# EAGLE schematic reg-board (EAGLE 8.7.0)

## Sheet 1 of 5: Bus Buffering
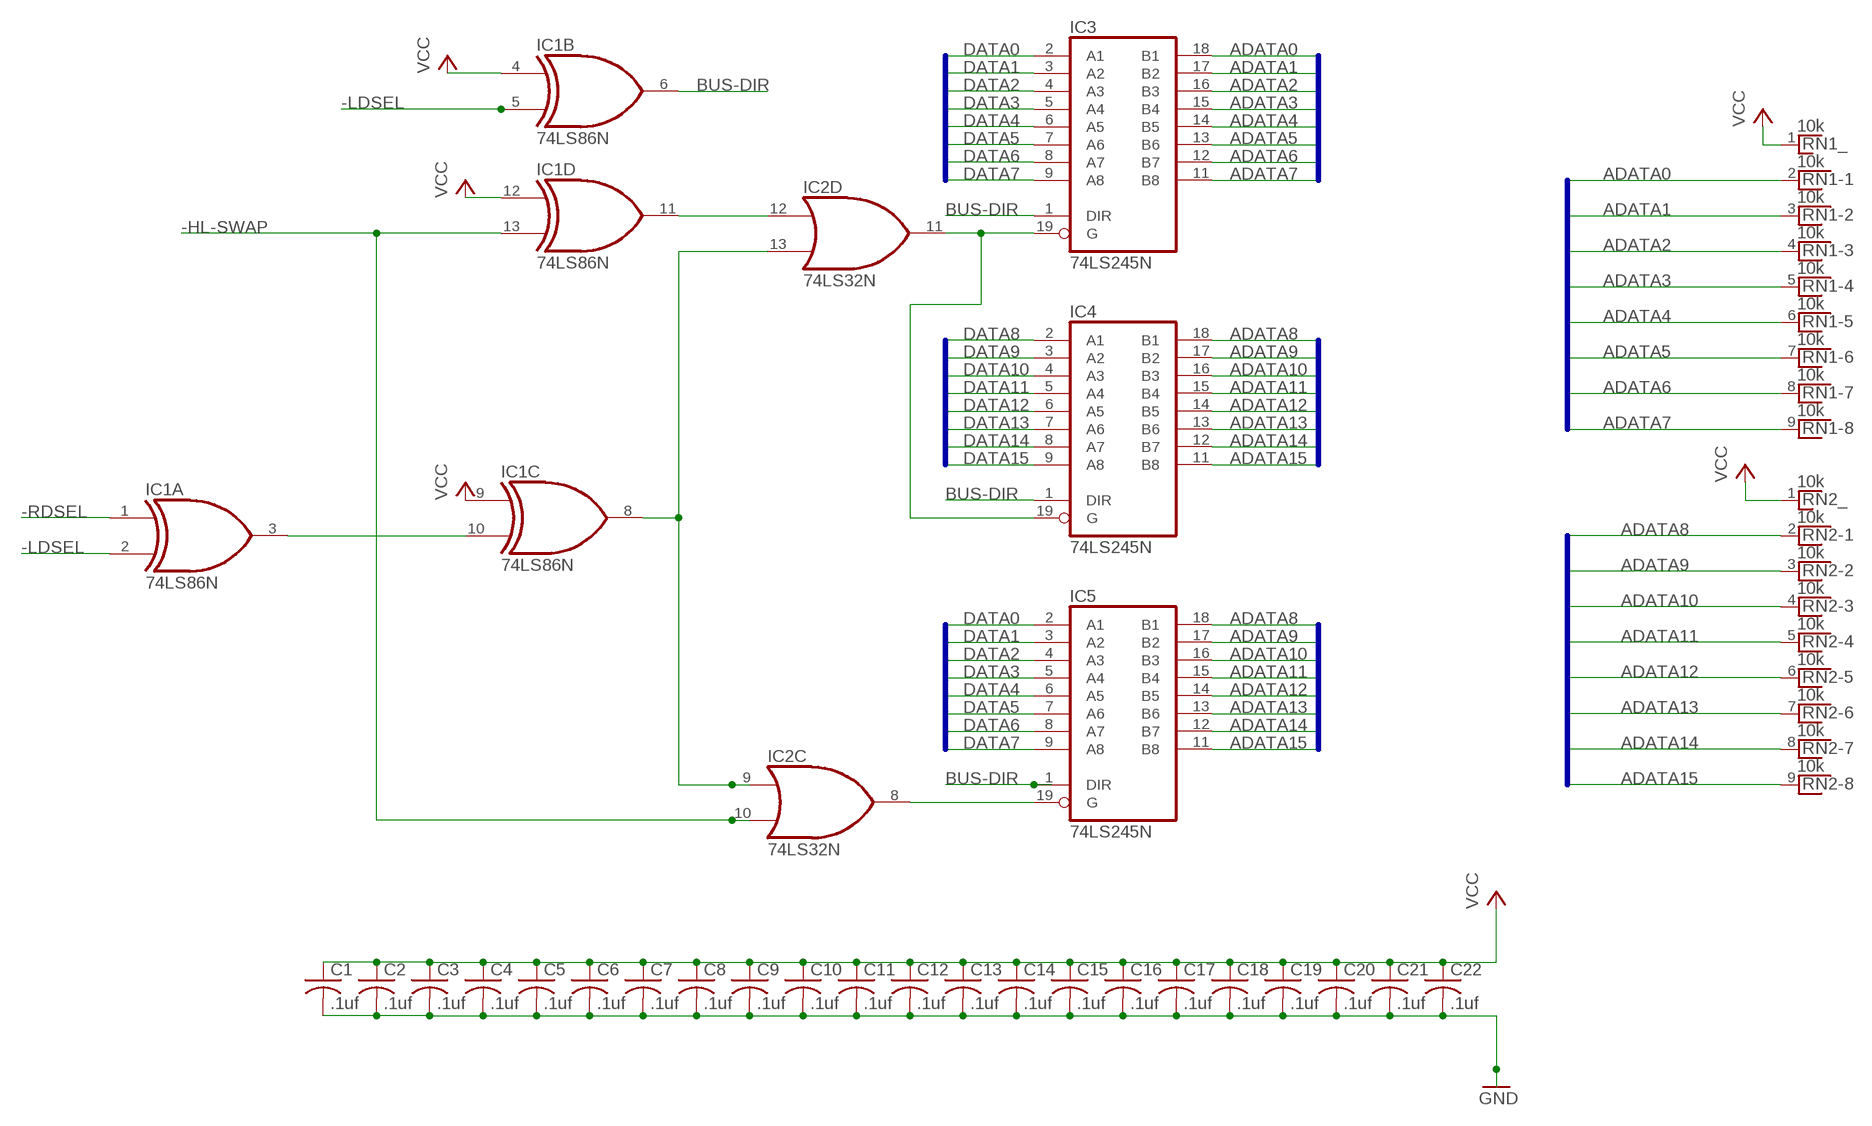
[diagram p0: schematic, sheet 1]

### Parts
C1  .1uf  C-US025-040X050  [C025-040X050]
C2  .1uf  C-US025-040X050  [C025-040X050]
C3  .1uf  C-US025-040X050  [C025-040X050]
C4  .1uf  C-US025-040X050  [C025-040X050]
C5  .1uf  C-US025-040X050  [C025-040X050]
C6  .1uf  C-US025-040X050  [C025-040X050]
C7  .1uf  C-US025-040X050  [C025-040X050]
C8  .1uf  C-US025-040X050  [C025-040X050]
C9  .1uf  C-US025-040X050  [C025-040X050]
C10  .1uf  C-US025-040X050  [C025-040X050]
C11  .1uf  C-US025-040X050  [C025-040X050]
C12  .1uf  C-US025-040X050  [C025-040X050]
C13  .1uf  C-US025-040X050  [C025-040X050]
C14  .1uf  C-US025-040X050  [C025-040X050]
C15  .1uf  C-US025-040X050  [C025-040X050]
C16  .1uf  C-US025-040X050  [C025-040X050]
C17  .1uf  C-US025-040X050  [C025-040X050]
C18  .1uf  C-US025-040X050  [C025-040X050]
C19  .1uf  C-US025-040X050  [C025-040X050]
C20  .1uf  C-US025-040X050  [C025-040X050]
C21  .1uf  C-US025-040X050  [C025-040X050]
C22  .1uf  C-US025-040X050  [C025-040X050]
IC1  74LS86N  [DIL14]
IC2  74LS32N  [DIL14]
IC3  74LS245N  [DIL20]
IC4  74LS245N  [DIL20]
IC5  74LS245N  [DIL20]
RN1  10k  RNX8  [RN-9]
RN2  10k  RNX8  [RN-9]

### Nets
-HL-SWAP: IC1.13(D:I1) IC2.10(C:I1) ; also sheet 4
-LDSEL: IC1.2(A:I1) IC1.5(B:I1) ; also sheet 5
-RDSEL: IC1.1(A:I0) ; also sheet 5
ADATA0: IC3.18(B1) RN1.2 ; also sheet 2,3
ADATA1: IC3.17(B2) RN1.3 ; also sheet 2,3
ADATA2: IC3.16(B3) RN1.4 ; also sheet 2,3
ADATA3: IC3.15(B4) RN1.5 ; also sheet 2,3
ADATA4: IC3.14(B5) RN1.6 ; also sheet 2,3
ADATA5: IC3.13(B6) RN1.7 ; also sheet 2,3
ADATA6: IC3.12(B7) RN1.8 ; also sheet 2,3
ADATA7: IC3.11(B8) RN1.9 ; also sheet 2,3
ADATA8: IC4.18(B1) IC5.18(B1) RN2.2 ; also sheet 2,3
ADATA9: IC4.17(B2) IC5.17(B2) RN2.3 ; also sheet 2,3
ADATA10: IC4.16(B3) IC5.16(B3) RN2.4 ; also sheet 2,3
ADATA11: IC4.15(B4) IC5.15(B4) RN2.5 ; also sheet 2,3
ADATA12: IC4.14(B5) IC5.14(B5) RN2.6 ; also sheet 2,3
ADATA13: IC4.13(B6) IC5.13(B6) RN2.7 ; also sheet 2,3
ADATA14: IC4.12(B7) IC5.12(B7) RN2.8 ; also sheet 2,3
ADATA15: IC4.11(B8) IC5.11(B8) RN2.9 ; also sheet 2,3
BUS-DIR: IC1.6(B:O) IC3.1(DIR) IC4.1(DIR) IC5.1(DIR)
DATA0: IC3.2(A1) IC5.2(A1) ; also sheet 4
DATA1: IC3.3(A2) IC5.3(A2) ; also sheet 4
DATA2: IC3.4(A3) IC5.4(A3) ; also sheet 4
DATA3: IC3.5(A4) IC5.5(A4) ; also sheet 4
DATA4: IC3.6(A5) IC5.6(A5) ; also sheet 4
DATA5: IC3.7(A6) IC5.7(A6) ; also sheet 4
DATA6: IC3.8(A7) IC5.8(A7) ; also sheet 4
DATA7: IC3.9(A8) IC5.9(A8) ; also sheet 4
DATA8: IC4.2(A1) ; also sheet 4
DATA9: IC4.3(A2) ; also sheet 4
DATA10: IC4.4(A3) ; also sheet 4
DATA11: IC4.5(A4) ; also sheet 4
DATA12: IC4.6(A5) ; also sheet 4
DATA13: IC4.7(A6) ; also sheet 4
DATA14: IC4.8(A7) ; also sheet 4
DATA15: IC4.9(A8) ; also sheet 4
GND: C1.2 C2.2 C3.2 C4.2 C5.2 C6.2 C7.2 C8.2 C9.2 C10.2 C11.2 C12.2 C13.2 C14.2 C15.2 C16.2 C17.2 C18.2 C19.2 C20.2 C21.2 C22.2 ; also sheet 3,4
N$2: IC1.8(C:O) IC2.9(C:I0) IC2.13(D:I1)
N$3: IC1.3(A:O) IC1.10(C:I1)
N$5: IC1.11(D:O) IC2.12(D:I0)
N$37: IC2.8(C:O) IC5.19(G)
N$38: IC2.11(D:O) IC3.19(G) IC4.19(G)
VCC: C1.1 C2.1 C3.1 C4.1 C5.1 C6.1 C7.1 C8.1 C9.1 C10.1 C11.1 C12.1 C13.1 C14.1 C15.1 C16.1 C17.1 C18.1 C19.1 C20.1 C21.1 C22.1 IC1.4(B:I0) IC1.9(C:I0) IC1.12(D:I0) RN1.1 RN2.1 ; also sheet 3,4

### Buses
DATA[8..15]
DATA[0..7]
ADATA[0..7]
ADATA[8..15]

## Sheet 2 of 5: REGISTER FILE 1/2
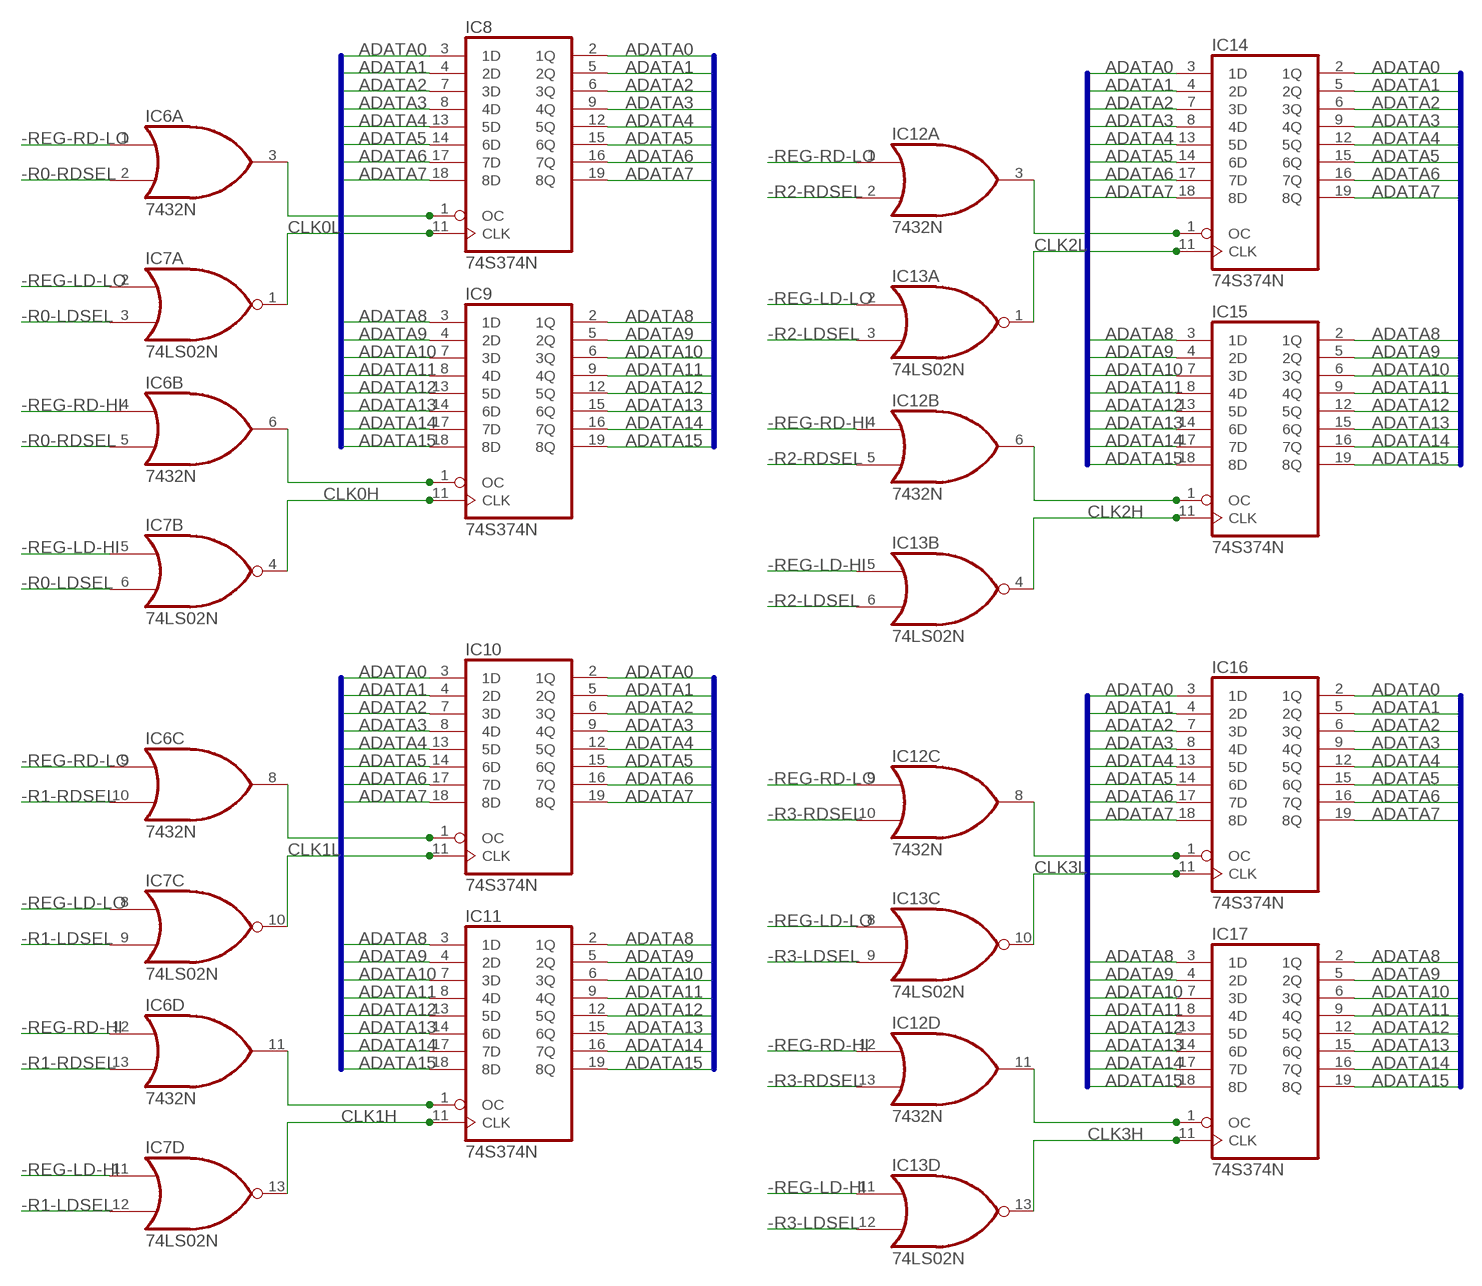
[diagram p1: schematic, sheet 2]

### Parts
IC6  7432N  [DIL14]
IC7  74LS02N  [DIL14]
IC8  74S374N  [DIL20]
IC9  74S374N  [DIL20]
IC10  74S374N  [DIL20]
IC11  74S374N  [DIL20]
IC12  7432N  [DIL14]
IC13  74LS02N  [DIL14]
IC14  74S374N  [DIL20]
IC15  74S374N  [DIL20]
IC16  74S374N  [DIL20]
IC17  74S374N  [DIL20]

### Nets
-R0-LDSEL: IC7.3(A:I1) IC7.6(B:I1) ; also sheet 5
-R0-RDSEL: IC6.2(A:I1) IC6.5(B:I1) ; also sheet 5
-R1-LDSEL: IC7.9(C:I1) IC7.12(D:I1) ; also sheet 5
-R1-RDSEL: IC6.10(C:I1) IC6.13(D:I1) ; also sheet 5
-R2-LDSEL: IC13.3(A:I1) IC13.6(B:I1) ; also sheet 5
-R2-RDSEL: IC12.2(A:I1) IC12.5(B:I1) ; also sheet 5
-R3-LDSEL: IC13.9(C:I1) IC13.12(D:I1) ; also sheet 5
-R3-RDSEL: IC12.10(C:I1) IC12.13(D:I1) ; also sheet 5
-REG-LD-HI: IC7.5(B:I0) IC7.11(D:I0) IC13.5(B:I0) IC13.11(D:I0) ; also sheet 4
-REG-LD-LO: IC7.2(A:I0) IC7.8(C:I0) IC13.2(A:I0) IC13.8(C:I0) ; also sheet 4
-REG-RD-HI: IC6.4(B:I0) IC6.12(D:I0) IC12.4(B:I0) IC12.12(D:I0) ; also sheet 4
-REG-RD-LO: IC6.1(A:I0) IC6.9(C:I0) IC12.1(A:I0) IC12.9(C:I0) ; also sheet 4
ADATA0: IC8.2(1Q) IC8.3(1D) IC10.2(1Q) IC10.3(1D) IC14.2(1Q) IC14.3(1D) IC16.2(1Q) IC16.3(1D) ; also sheet 1,3
ADATA1: IC8.4(2D) IC8.5(2Q) IC10.4(2D) IC10.5(2Q) IC14.4(2D) IC14.5(2Q) IC16.4(2D) IC16.5(2Q) ; also sheet 1,3
ADATA2: IC8.6(3Q) IC8.7(3D) IC10.6(3Q) IC10.7(3D) IC14.6(3Q) IC14.7(3D) IC16.6(3Q) IC16.7(3D) ; also sheet 1,3
ADATA3: IC8.8(4D) IC8.9(4Q) IC10.8(4D) IC10.9(4Q) IC14.8(4D) IC14.9(4Q) IC16.8(4D) IC16.9(4Q) ; also sheet 1,3
ADATA4: IC8.12(5Q) IC8.13(5D) IC10.12(5Q) IC10.13(5D) IC14.12(5Q) IC14.13(5D) IC16.12(5Q) IC16.13(5D) ; also sheet 1,3
ADATA5: IC8.14(6D) IC8.15(6Q) IC10.14(6D) IC10.15(6Q) IC14.14(6D) IC14.15(6Q) IC16.14(6D) IC16.15(6Q) ; also sheet 1,3
ADATA6: IC8.16(7Q) IC8.17(7D) IC10.16(7Q) IC10.17(7D) IC14.16(7Q) IC14.17(7D) IC16.16(7Q) IC16.17(7D) ; also sheet 1,3
ADATA7: IC8.18(8D) IC8.19(8Q) IC10.18(8D) IC10.19(8Q) IC14.18(8D) IC14.19(8Q) IC16.18(8D) IC16.19(8Q) ; also sheet 1,3
ADATA8: IC9.2(1Q) IC9.3(1D) IC11.2(1Q) IC11.3(1D) IC15.2(1Q) IC15.3(1D) IC17.2(1Q) IC17.3(1D) ; also sheet 1,3
ADATA9: IC9.4(2D) IC9.5(2Q) IC11.4(2D) IC11.5(2Q) IC15.4(2D) IC15.5(2Q) IC17.4(2D) IC17.5(2Q) ; also sheet 1,3
ADATA10: IC9.6(3Q) IC9.7(3D) IC11.6(3Q) IC11.7(3D) IC15.6(3Q) IC15.7(3D) IC17.6(3Q) IC17.7(3D) ; also sheet 1,3
ADATA11: IC9.8(4D) IC9.9(4Q) IC11.8(4D) IC11.9(4Q) IC15.8(4D) IC15.9(4Q) IC17.8(4D) IC17.9(4Q) ; also sheet 1,3
ADATA12: IC9.12(5Q) IC9.13(5D) IC11.12(5Q) IC11.13(5D) IC15.12(5Q) IC15.13(5D) IC17.12(5Q) IC17.13(5D) ; also sheet 1,3
ADATA13: IC9.14(6D) IC9.15(6Q) IC11.14(6D) IC11.15(6Q) IC15.14(6D) IC15.15(6Q) IC17.14(6D) IC17.15(6Q) ; also sheet 1,3
ADATA14: IC9.16(7Q) IC9.17(7D) IC11.16(7Q) IC11.17(7D) IC15.16(7Q) IC15.17(7D) IC17.16(7Q) IC17.17(7D) ; also sheet 1,3
ADATA15: IC9.18(8D) IC9.19(8Q) IC11.18(8D) IC11.19(8Q) IC15.18(8D) IC15.19(8Q) IC17.18(8D) IC17.19(8Q) ; also sheet 1,3
CLK0H: IC7.4(B:O) IC9.11(CLK) ; also sheet 3
CLK0L: IC7.1(A:O) IC8.11(CLK) ; also sheet 3
CLK1H: IC7.13(D:O) IC11.11(CLK) ; also sheet 3
CLK1L: IC7.10(C:O) IC10.11(CLK) ; also sheet 3
CLK2H: IC13.4(B:O) IC15.11(CLK) ; also sheet 3
CLK2L: IC13.1(A:O) IC14.11(CLK) ; also sheet 3
CLK3H: IC13.13(D:O) IC17.11(CLK) ; also sheet 3
CLK3L: IC13.10(C:O) IC16.11(CLK) ; also sheet 3
N$1: IC6.3(A:O) IC8.1(OC)
N$12: IC6.8(C:O) IC10.1(OC)
N$15: IC12.3(A:O) IC14.1(OC)
N$17: IC12.8(C:O) IC16.1(OC)
N$19: IC6.11(D:O) IC11.1(OC)
N$21: IC12.11(D:O) IC17.1(OC)
N$23: IC12.6(B:O) IC15.1(OC)
N$25: IC6.6(B:O) IC9.1(OC)

### Buses
ADATA[0..15]

## Sheet 3 of 5: FRONT PANEL CONNECTOR
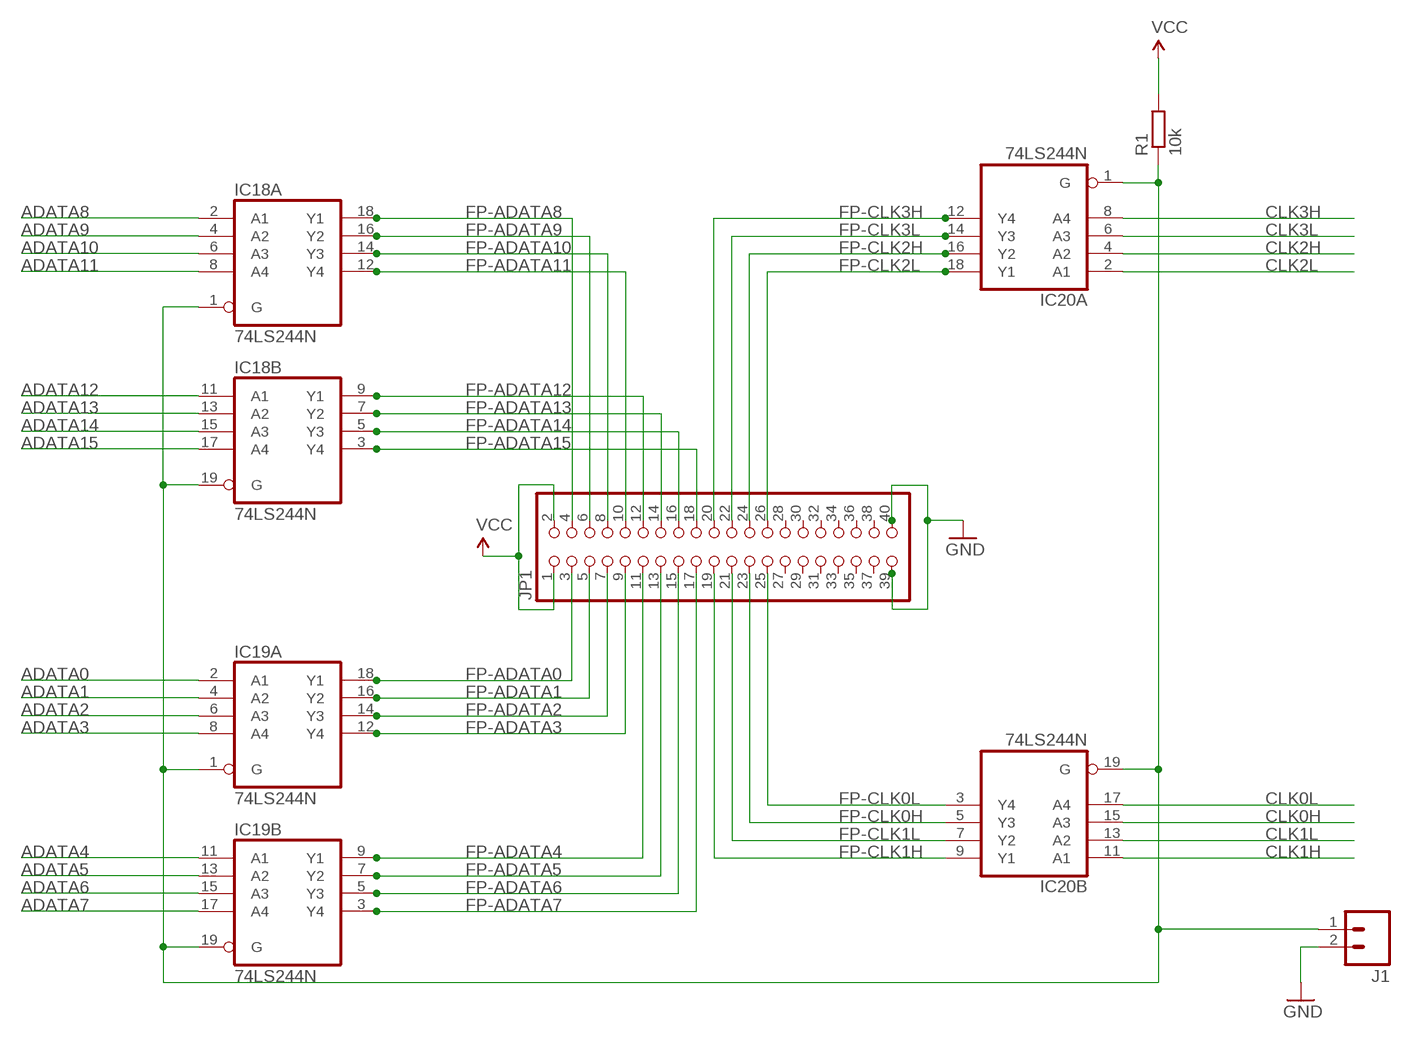
[diagram p2: schematic, sheet 3]

### Parts
IC18  74LS244N  [DIL20]
IC19  74LS244N  [DIL20]
IC20  74LS244N  [DIL20]
J1  M02PTH  [1X02]
JP1  PINHD-2X20  [2X20]
R1  10k  R0207/10  [0207/10]

### Nets
ADATA0: IC19.2(A:A1) ; also sheet 1,2
ADATA1: IC19.4(A:A2) ; also sheet 1,2
ADATA2: IC19.6(A:A3) ; also sheet 1,2
ADATA3: IC19.8(A:A4) ; also sheet 1,2
ADATA4: IC19.11(B:A1) ; also sheet 1,2
ADATA5: IC19.13(B:A2) ; also sheet 1,2
ADATA6: IC19.15(B:A3) ; also sheet 1,2
ADATA7: IC19.17(B:A4) ; also sheet 1,2
ADATA8: IC18.2(A:A1) ; also sheet 1,2
ADATA9: IC18.4(A:A2) ; also sheet 1,2
ADATA10: IC18.6(A:A3) ; also sheet 1,2
ADATA11: IC18.8(A:A4) ; also sheet 1,2
ADATA12: IC18.11(B:A1) ; also sheet 1,2
ADATA13: IC18.13(B:A2) ; also sheet 1,2
ADATA14: IC18.15(B:A3) ; also sheet 1,2
ADATA15: IC18.17(B:A4) ; also sheet 1,2
CLK0H: IC20.15(B:A3) ; also sheet 2
CLK0L: IC20.17(B:A4) ; also sheet 2
CLK1H: IC20.11(B:A1) ; also sheet 2
CLK1L: IC20.13(B:A2) ; also sheet 2
CLK2H: IC20.4(A:A2) ; also sheet 2
CLK2L: IC20.2(A:A1) ; also sheet 2
CLK3H: IC20.8(A:A4) ; also sheet 2
CLK3L: IC20.6(A:A3) ; also sheet 2
FP-ADATA0: IC19.18(A:Y1) JP1.3
FP-ADATA1: IC19.16(A:Y2) JP1.5
FP-ADATA2: IC19.14(A:Y3) JP1.7
FP-ADATA3: IC19.12(A:Y4) JP1.9
FP-ADATA4: IC19.9(B:Y1) JP1.11
FP-ADATA5: IC19.7(B:Y2) JP1.13
FP-ADATA6: IC19.5(B:Y3) JP1.15
FP-ADATA7: IC19.3(B:Y4) JP1.17
FP-ADATA8: IC18.18(A:Y1) JP1.4
FP-ADATA9: IC18.16(A:Y2) JP1.6
FP-ADATA10: IC18.14(A:Y3) JP1.8
FP-ADATA11: IC18.12(A:Y4) JP1.10
FP-ADATA12: IC18.9(B:Y1) JP1.12
FP-ADATA13: IC18.7(B:Y2) JP1.14
FP-ADATA14: IC18.5(B:Y3) JP1.16
FP-ADATA15: IC18.3(B:Y4) JP1.18
FP-CLK0H: IC20.5(B:Y3) JP1.23
FP-CLK0L: IC20.3(B:Y4) JP1.25
FP-CLK1H: IC20.9(B:Y1) JP1.19
FP-CLK1L: IC20.7(B:Y2) JP1.21
FP-CLK2H: IC20.16(A:Y2) JP1.24
FP-CLK2L: IC20.18(A:Y1) JP1.26
FP-CLK3H: IC20.12(A:Y4) JP1.20
FP-CLK3L: IC20.14(A:Y3) JP1.22
GND: J1.2 JP1.39 JP1.40 ; also sheet 1,4
N$8: IC18.1(A:G) IC18.19(B:G) IC19.1(A:G) IC19.19(B:G) IC20.1(A:G) IC20.19(B:G) J1.1 R1.1
VCC: JP1.1 JP1.2 R1.2 ; also sheet 1,4
Unconnected: JP1.27 JP1.28 JP1.29 JP1.30 JP1.31 JP1.32 JP1.33 JP1.34 JP1.35 JP1.36 JP1.37 JP1.38

## Sheet 4 of 5: BUS
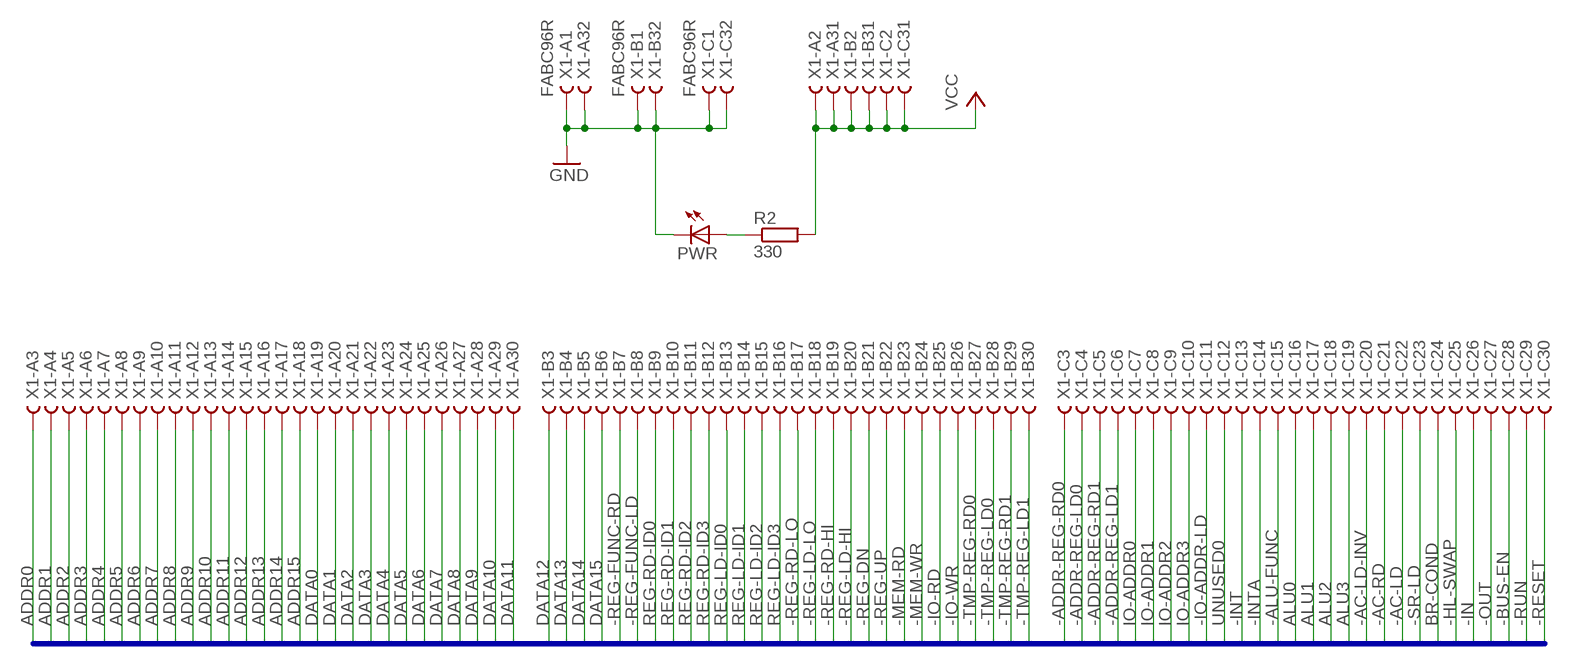
[diagram p3: schematic, sheet 4]

### Parts
PWR  LED5MM  [LED5MM]
R2  330  R0207/10  [0207/10]
X1  FABC96R  [FABC96R]

### Nets
-AC-LD: X1.C22
-AC-LD-INV: X1.C20
-AC-RD: X1.C21
-ADDR-REG-LD0: X1.C4
-ADDR-REG-LD1: X1.C6
-ADDR-REG-RD0: X1.C3
-ADDR-REG-RD1: X1.C5
-ALU-FUNC: X1.C15
-BUS-EN: X1.C28 ; also sheet 5
-HL-SWAP: X1.C25 ; also sheet 1
-IN: X1.C26
-INT: X1.C13
-INTA: X1.C14
-IO-ADDR-LD: X1.C11
-IO-RD: X1.B25
-IO-WR: X1.B26
-MEM-RD: X1.B23
-MEM-WR: X1.B24
-OUT: X1.C27
-REG-DN: X1.B21
-REG-FUNC-LD: X1.B8 ; also sheet 5
-REG-FUNC-RD: X1.B7 ; also sheet 5
-REG-LD-HI: X1.B20 ; also sheet 2
-REG-LD-LO: X1.B18 ; also sheet 2
-REG-RD-HI: X1.B19 ; also sheet 2
-REG-RD-LO: X1.B17 ; also sheet 2
-REG-UP: X1.B22
-RESET: X1.C30
-RUN: X1.C29
-SR-LD: X1.C23
-TMP-REG-LD0: X1.B28
-TMP-REG-LD1: X1.B30
-TMP-REG-RD0: X1.B27
-TMP-REG-RD1: X1.B29
ADDR0: X1.A3
ADDR1: X1.A4
ADDR2: X1.A5
ADDR3: X1.A6
ADDR4: X1.A7
ADDR5: X1.A8
ADDR6: X1.A9
ADDR7: X1.A10
ADDR8: X1.A11
ADDR9: X1.A12
ADDR10: X1.A13
ADDR11: X1.A14
ADDR12: X1.A15
ADDR13: X1.A16
ADDR14: X1.A17
ADDR15: X1.A18
ALU0: X1.C16
ALU1: X1.C17
ALU2: X1.C18
ALU3: X1.C19
BR-COND: X1.C24
DATA0: X1.A19 ; also sheet 1
DATA1: X1.A20 ; also sheet 1
DATA2: X1.A21 ; also sheet 1
DATA3: X1.A22 ; also sheet 1
DATA4: X1.A23 ; also sheet 1
DATA5: X1.A24 ; also sheet 1
DATA6: X1.A25 ; also sheet 1
DATA7: X1.A26 ; also sheet 1
DATA8: X1.A27 ; also sheet 1
DATA9: X1.A28 ; also sheet 1
DATA10: X1.A29 ; also sheet 1
DATA11: X1.A30 ; also sheet 1
DATA12: X1.B3 ; also sheet 1
DATA13: X1.B4 ; also sheet 1
DATA14: X1.B5 ; also sheet 1
DATA15: X1.B6 ; also sheet 1
GND: PWR.K(C) X1.A1 X1.A32 X1.B1 X1.B32 X1.C1 X1.C32 ; also sheet 1,3
IO-ADDR0: X1.C7
IO-ADDR1: X1.C8
IO-ADDR2: X1.C9
IO-ADDR3: X1.C10
N$11: PWR.A R2.1
REG-LD-ID0: X1.B13 ; also sheet 5
REG-LD-ID1: X1.B14 ; also sheet 5
REG-LD-ID2: X1.B15 ; also sheet 5
REG-LD-ID3: X1.B16 ; also sheet 5
REG-RD-ID0: X1.B9 ; also sheet 5
REG-RD-ID1: X1.B10 ; also sheet 5
REG-RD-ID2: X1.B11 ; also sheet 5
REG-RD-ID3: X1.B12 ; also sheet 5
UNUSED0: X1.C12
VCC: R2.2 X1.A2 X1.A31 X1.B2 X1.B31 X1.C2 X1.C31 ; also sheet 1,3

### Buses
ADDR[0..15],DATA[0..15],-REG-FUNC-RD,-REG-FUNC-LD,REG-RD-ID[0..3],REG-LD-ID[0..3],-REG-RD-LO,-REG-LD-LO,-REG-RD-HI,-REG-LD-HI,-REG-DN,-REG-UP,-MEM-RD,-MEM-WR,-IO-RD,-IO-WR,-TMP-REG-RD[0..1],-TMP-REG-LD[0..1],-ADDR-REG-RD[0..1],-ADDR-REG-LD[0..1],IO-ADDR[0..3],-IO-ADDR-LD,UNUSED0,-INT,-INTA,-ALU-FUNC,ALU[0..3],-AC-LD-INV,-AC-LD,-AC-RD,-SR-LD,BR-COND,-HL-SWAP,-IN,-OUT,-BUS-EN,-RESET,-RUN

## Sheet 5 of 5: SELECTION
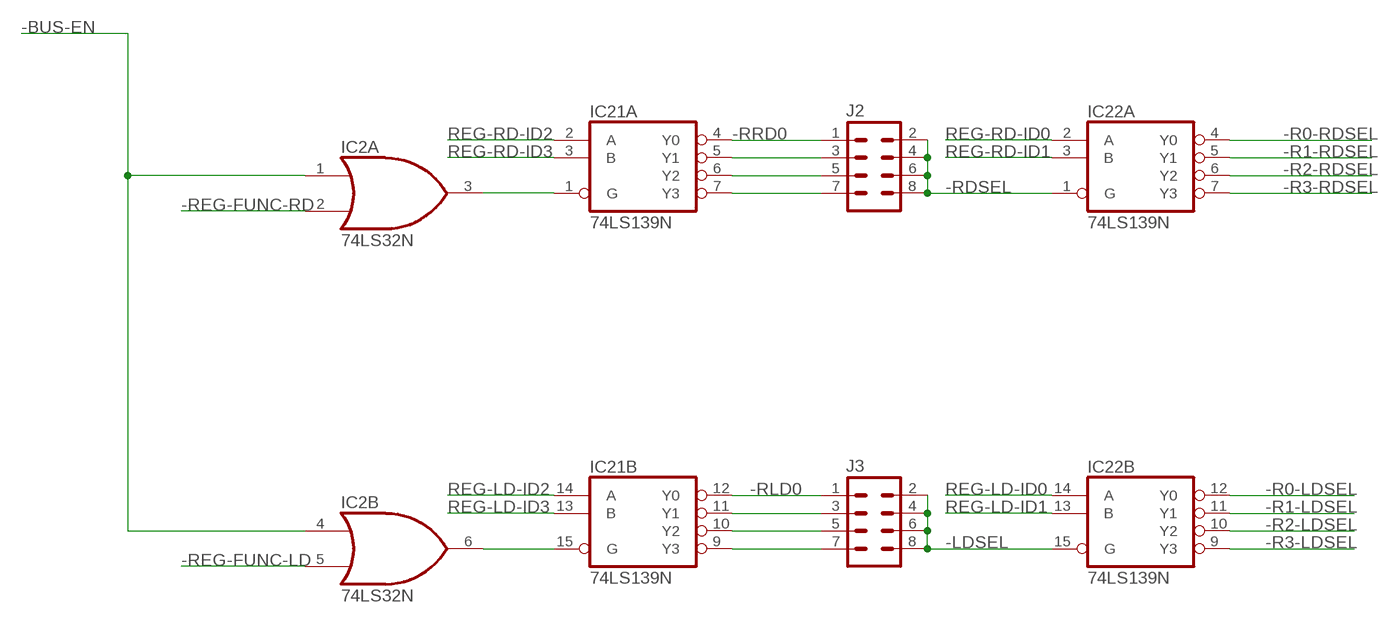
[diagram p4: schematic, sheet 5]

### Parts
IC21  74LS139N  [DIL16]
IC22  74LS139N  [DIL16]
J2  M04X2  [2X4]
J3  M04X2  [2X4]

### Nets
-BUS-EN: IC2.1(A:I0) IC2.4(B:I0) ; also sheet 4
-LDSEL: IC22.15(B:G) J3.2 J3.4 J3.6 J3.8 ; also sheet 1
-R0-LDSEL: IC22.12(B:Y0) ; also sheet 2
-R0-RDSEL: IC22.4(A:Y0) ; also sheet 2
-R1-LDSEL: IC22.11(B:Y1) ; also sheet 2
-R1-RDSEL: IC22.5(A:Y1) ; also sheet 2
-R2-LDSEL: IC22.10(B:Y2) ; also sheet 2
-R2-RDSEL: IC22.6(A:Y2) ; also sheet 2
-R3-LDSEL: IC22.9(B:Y3) ; also sheet 2
-R3-RDSEL: IC22.7(A:Y3) ; also sheet 2
-RDSEL: IC22.1(A:G) J2.2 J2.4 J2.6 J2.8 ; also sheet 1
-REG-FUNC-LD: IC2.5(B:I1) ; also sheet 4
-REG-FUNC-RD: IC2.2(A:I1) ; also sheet 4
-RLD0: IC21.12(B:Y0) J3.1
-RRD0: IC21.4(A:Y0) J2.1
N$6: IC2.3(A:O) IC21.1(A:G)
N$7: IC2.6(B:O) IC21.15(B:G)
N$16: IC21.5(A:Y1) J2.3
N$18: IC21.6(A:Y2) J2.5
N$20: IC21.7(A:Y3) J2.7
N$24: IC21.11(B:Y1) J3.3
N$26: IC21.10(B:Y2) J3.5
N$27: IC21.9(B:Y3) J3.7
REG-LD-ID0: IC22.14(B:A) ; also sheet 4
REG-LD-ID1: IC22.13(B:B) ; also sheet 4
REG-LD-ID2: IC21.14(B:A) ; also sheet 4
REG-LD-ID3: IC21.13(B:B) ; also sheet 4
REG-RD-ID0: IC22.2(A:A) ; also sheet 4
REG-RD-ID1: IC22.3(A:B) ; also sheet 4
REG-RD-ID2: IC21.2(A:A) ; also sheet 4
REG-RD-ID3: IC21.3(A:B) ; also sheet 4

## Power pins joined to a net without a drawn wire
GND: IC1.7(P:GND) IC2.7(P:GND) IC3.10(GND) IC4.10(GND) IC5.10(GND) IC6.7(P:GND) IC7.7(P:GND) IC8.10(GND) IC9.10(GND) IC10.10(GND) IC11.10(GND) IC12.7(P:GND) IC13.7(P:GND) IC14.10(GND) IC15.10(GND) IC16.10(GND) IC17.10(GND) IC18.10(P:GND) IC19.10(P:GND) IC20.10(P:GND) IC21.8(P:GND) IC22.8(P:GND)
VCC: IC1.14(P:VCC) IC2.14(P:VCC) IC3.20(VCC) IC4.20(VCC) IC5.20(VCC) IC6.14(P:VCC) IC7.14(P:VCC) IC8.20(VCC) IC9.20(VCC) IC10.20(VCC) IC11.20(VCC) IC12.14(P:VCC) IC13.14(P:VCC) IC14.20(VCC) IC15.20(VCC) IC16.20(VCC) IC17.20(VCC) IC18.20(P:VCC) IC19.20(P:VCC) IC20.20(P:VCC) IC21.16(P:VCC) IC22.16(P:VCC)

## Library data of the parts
C1-C22 = rcl:C-US: CAPACITOR, American symbol
IC1 = 74xx-us:74*86: Quad 2-input EXCLUSIV-OR (XOR) gate
IC2 IC6 IC12 = 74xx-us:74*32: Quad 2-input OR gate
IC3-IC5 = 74xx-us:74*245: Octal BUS TRANSCEIVER, 3-state
IC7 IC13 = 74xx-us:74*02: Quad 2-input NOR gate
IC8-IC11 IC14-IC17 = 74xx-us:74*374: Octal D type transparent LATCH, edge triggered
IC18-IC20 = 74xx-us:74*244: Octal BUFFER and LINE DRIVER, 3-state
IC21 IC22 = 74xx-us:74*139: Dual 2-line to 4-line DECODER/DEMULTIPLEXER
J1 = SparkFun-Connectors:M02: Standard 2-pin 0.1" header. Use with - straight break away headers ( PRT-00116) - right angle break away headers (PRT-00553) - swiss pins (PRT-00743) - machine pins (PRT-00117) - female headers (PRT-00115) Molex polarized connector foot print use with: PRT-08233 with associated crimp pins and housings. 2.54_SCREWTERM for use with PRT-10571. 3.5mm Screw Terminal footprints for PRT-08084 5mm Screw Terminal footprints for use with PRT-08432
J2 J3 = SparkFun-Connectors:M04X2: .1" header, two rows of four.
JP1 = pinhead:PINHD-2X20: PIN HEADER
PWR = led:LED: LED OSRAM: - CHIPLED LG R971, LG N971, LY N971, LG Q971, LY Q971, LO R971, LY R971 LH N974, LH R974 LS Q976, LO Q976, LY Q976 LO Q996 - Hyper CHIPLED LW Q18S LB Q993, LB Q99A, LB R99A - SideLED LS A670, LO A670, LY A670, LG A670, LP A670 LB A673, LV A673, LT A673, LW A673 LH A674 LY A675 LS A676, LA A676, LO A676, LY A676, LW A676 LS A679, LY A679, LG A679 - Hyper Micro SIDELED® LS Y876, LA Y876, LO Y876, LY Y876 LT Y87S - SmartLED LW L88C, LW L88S LB L89C, LB L89S, LG L890 LS L89K, LO L89K, LY L89K LS L896, LA L896, LO L896, LY L896 - TOPLED LS T670, LO T670, LY T670, LG T670, LP T670 LSG T670, LSP T670, LSY T670, LOP T670, LYG T670 LG T671, LOG T671, LSG T671 LB T673, LV T673, LT T673, LW T673 LH T674 LS T676, LA T676, LO T676, LY T676, LB T676, LH T676, LSB T676, LW T676 LB T67C, LV T67C, LT T67C, LS T67K, LO T67K, LY T67K, LW E67C LS E67B, LA E67B, LO E67B, LY E67B, LB E67C, LV E67C, LT E67C LW T67C LS T679, LY T679, LG T679 LS T770, LO T770, LY T770, LG T770, LP T770 LB T773, LV T773, LT T773, LW T773 LH T774 LS E675, LA E675, LY E675, LS T675 LS T776, LA T776, LO T776, LY T776, LB T776 LHGB T686 LT T68C, LB T68C - Hyper Mini TOPLED® LB M676 - Mini TOPLED Santana® LG M470 LS M47K, LO M47K, LY M47K Source: http://www.osram.convergy.de LUXEON: - LUMILED® LXK2-PW12-R00, LXK2-PW12-S00, LXK2-PW14-U00, LXK2-PW14-V00 LXK2-PM12-R00, LXK2-PM12-S00, LXK2-PM14-U00 LXK2-PE12-Q00, LXK2-PE12-R00, LXK2-PE12-S00, LXK2-PE14-T00, LXK2-PE14-U00 LXK2-PB12-K00, LXK2-PB12-L00, LXK2-PB12-M00, LXK2-PB14-N00, LXK2-PB14-P00, LXK2-PB14-Q00 LXK2-PR12-L00, LXK2-PR12-M00, LXK2-PR14-Q00, LXK2-PR14-R00 LXK2-PD12-Q00, LXK2-PD12-R00, LXK2-PD12-S00 LXK2-PH12-R00, LXK2-PH12-S00 LXK2-PL12-P00, LXK2-PL12-Q00, LXK2-PL12-R00 Source: www.luxeon.com KINGBRIGHT: KA-3528ASYC Source: www.kingbright.com
R1 R2 = eagle-ltspice:R: RESISTOR, European symbol; SPICEMODEL: NONE; SPICEPREFIX: R
RN1 RN2 = resistor-net:RNX8: RESISTOR NETWORK; OC_FARNELL: unknown; OC_NEWARK: unknown
X1 = con-vg:FABC96R: CONNECTOR female, 96 pins, type R, rows ABC, grid 2.54 mm

## Net classes
1 GND: width 1 mm
2 5V: width 1 mm